# Altium schematic sheet Connect.SchDoc
size A4
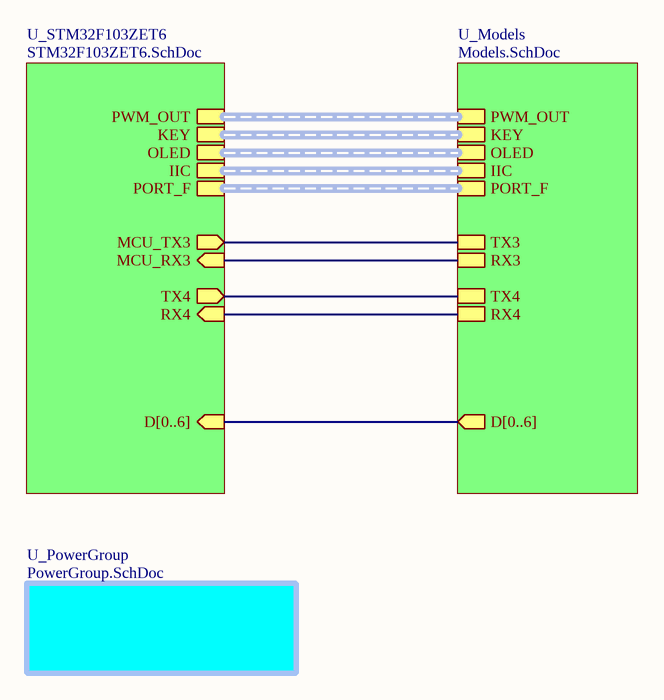
[diagram p0: Connect.SchDoc]

## Sub-sheets
U_Models = Models.SchDoc: PWM_OUT (harness PWM_OUT), KEY (harness KEY), OLED (harness OLED), IIC (harness IIC), PORT_F (harness PORT_F), D[0..6] (out), TX3, RX3, TX4, RX4
U_PowerGroup = PowerGroup.SchDoc: no entries
U_STM32F103ZET6 = STM32F103ZET6.SchDoc: PWM_OUT (harness PWM_OUT), D[0..6] (in), KEY (harness KEY), OLED (harness OLED), MCU_TX3 (out), MCU_RX3 (in), IIC (harness IIC), TX4 (out), RX4 (in), PORT_F (harness PORT_F)

## Nets
(unnamed): sheet U_STM32F103ZET6/MCU_TX3, sheet U_Models/TX3
(unnamed): sheet U_STM32F103ZET6/MCU_RX3, sheet U_Models/RX3
(unnamed): sheet U_STM32F103ZET6/TX4, sheet U_Models/TX4
(unnamed): sheet U_STM32F103ZET6/RX4, sheet U_Models/RX4

## Buses and harness runs
bus sheet U_Models/D[0..6] = sheet U_STM32F103ZET6/D[0..6]
harness sheet U_Models/IIC = sheet U_STM32F103ZET6/IIC
harness sheet U_Models/KEY = sheet U_STM32F103ZET6/KEY
harness sheet U_Models/OLED = sheet U_STM32F103ZET6/OLED
harness sheet U_Models/PORT_F = sheet U_STM32F103ZET6/PORT_F
harness sheet U_Models/PWM_OUT = sheet U_STM32F103ZET6/PWM_OUT